# Altium schematic sheet Powersupply.SchDoc
size A4; SheetNumber: 5; SheetTotal: 22
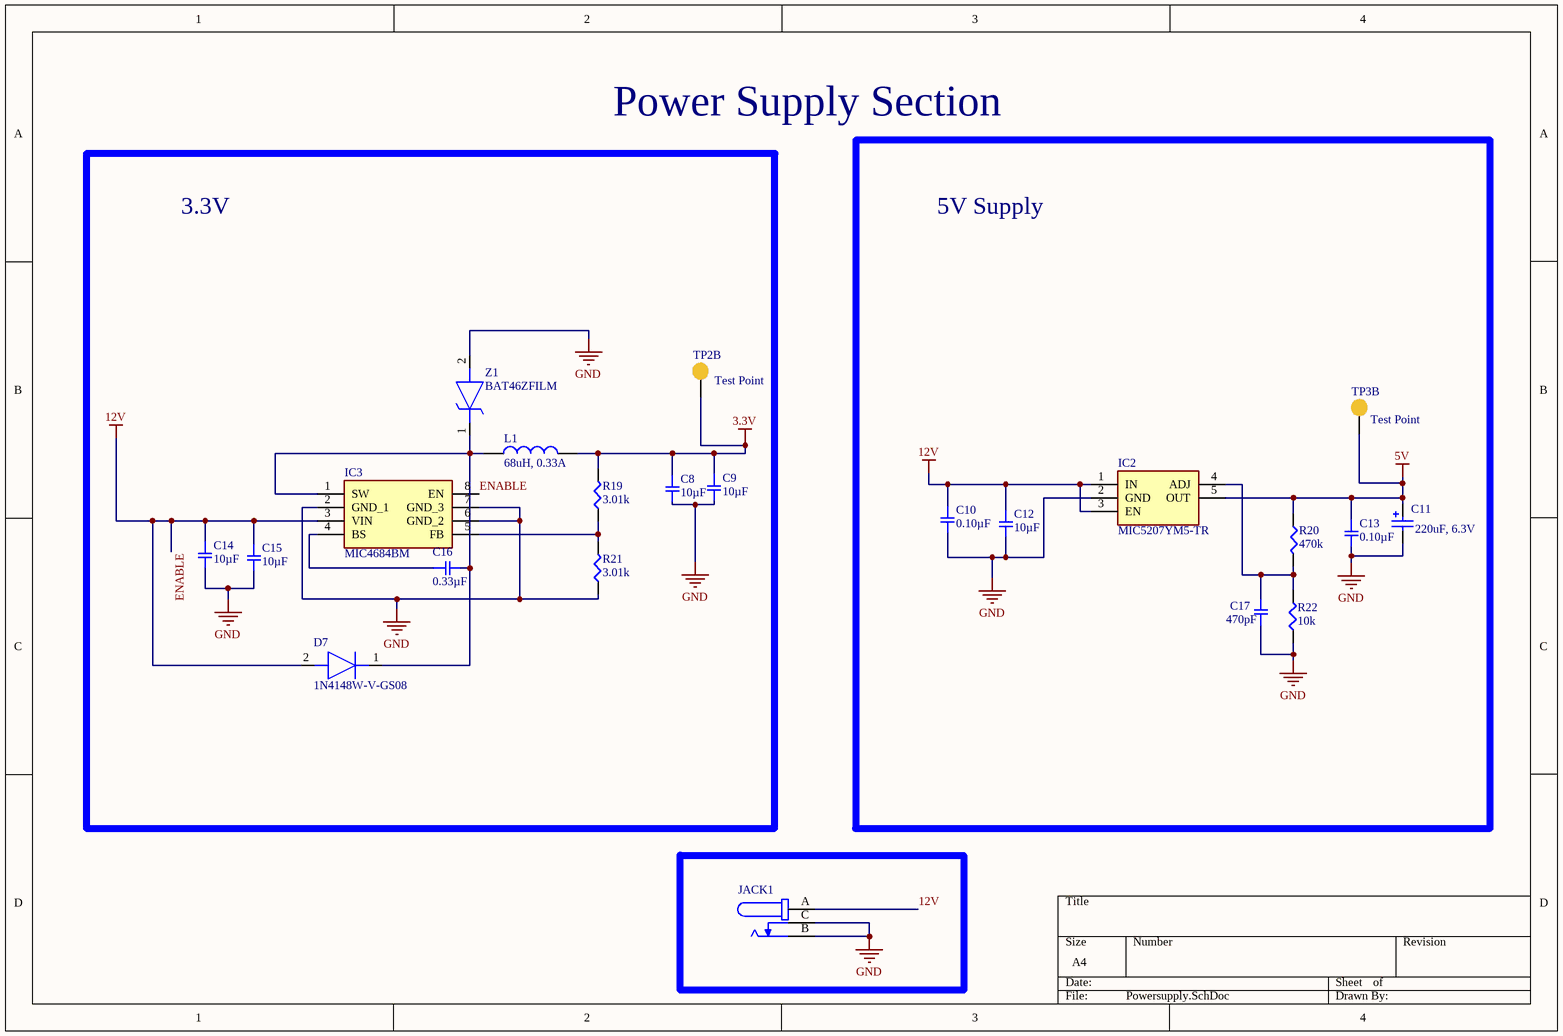
[diagram p0: Powersupply.SchDoc]

## Parts
C8  10µF  [SMD-0805C]
C9  10µF  [SMD-0805C]
C10  0.10µF  [SMD-0805C]
C11  220uF, 6.3V  [WCAP-ASLI_6.3x5.5]
C12  10µF  [SMD-0805C]
C13  0.10µF  [SMD-0805C]
C14  10µF  [SMD-0805C]
C15  10µF  [SMD-0805C]
C16  0.33µF  [SMD-0805C]
C17  470pF  [SMD-0805C]
D7  1N4148W-V-GS08  [1N4148WVGS08]
IC2  MIC5207YM5-TR  [SOT95P280X130-5N]
IC3  MIC4684BM  [SOIC127P602X173-8N]
JACK1  JACK  [JACK]  (value not drawn)
L1  68uH, 0.33A  [WE-LQ_1812]
R19  3.01k  [SMD-0805-RES]
R20  470k  [SMD-0805-RES]
R21  3.01k  [SMD-0805-RES]
R22  10k  [SMD-0805-RES]
TP2  Test Point  [pad2]  (part B of 2)
TP3  Test Point  [pad2]  (part B of 2)
Z1  BAT46ZFILM  [STPS0560Z]

## Blocks framed on the sheet
3.3V: C8 C9 C14-C16 D7 IC3 L1 R19 R21 TP2 Z1
5V Supply: C10-C13 C17 IC2 R20 R22 TP3

## Nets
3.3V: C8.1 C9.1 L1.2 R19.2 TP2.1
5V: C11.2(P) C13.1 IC2.5(OUT) R20.1 TP3.1
12V: C10.1 C12.1 C14.1 C15.1 D7.2(A) IC2.1(IN) IC2.3(EN) IC3.3(VIN) IC3.8(EN) JACK1.A  [also labelled ENABLE]
GND: C8.2 C9.2 C10.2 C11.1(N) C12.2 C13.2 C14.2 C15.2 C17.1 IC2.2(GND) IC3.2(GND_1) IC3.6(GND_2) IC3.7(GND_3) JACK1.B JACK1.C R21.1 R22.1 Z1.2(A)
NetC16_1: C16.1 IC3.4(BS)
NetC16_2: C16.2 D7.1(K) IC3.1(SW) L1.1 Z1.1(K)
NetC17_2: C17.2 IC2.4(ADJ) R20.2 R22.2
NetIC3_5: IC3.5(FB) R19.1 R21.2

## Notes on the sheet
- Power Supply Section

## Library data of the parts
C8 C9 C12 C14 C15 = GCJ21BR71A106KE01L: CAP CER 10UF 10V X7R 0805; Manufacturer: Murata Electronics North America; Factory Stock: 0; Unit Price (USD): 0.56; Minimum Quantity: 1; Tolerance: ±10%; Datasheets: http://www.murata.com/~/media/webrenewal/support/library/catalog/products/capacitor/mlcc/c03e.ashx; Image: //media.digikey.com/Renders/Murata%20Renders/0805%20(2012%20Metric)%20.85mm.jpg; Digi-Key Part Number: 490-12646-1-ND; Part Number: GCJ21BR71A106KE01L; Quantity Available: 2702; @ qty: 0; Packaging: Cut Tape (CT); Series: GCJ; Part Status: Active; Value: 10µF; Voltage: 10V; Temperature Coefficient: X7R; Operating Temperature: -55°C ~ 125°C; Features: Soft Termination; Ratings: AEC-Q200; Applications: Automotive, Boardflex Sensitive; Mounting Type: Surface Mount, MLCC; Package / Case: 0805 (2012 Metric); Size / Dimension: 0.079" L x 0.049" W (2.00mm x 1.25mm); Height - Seated (Max): -; Thickness (Max): 0.057" (1.45mm); Lead Spacing: -; Lead Style: -
C10 C13 = GCD21BR71H104KA01L: CAP CER 0.1UF 50V X7R 0805; Manufacturer: Murata Electronics North America; Factory Stock: 0; Unit Price (USD): 0.24; Minimum Quantity: 1; Tolerance: ±10%; Datasheets: http://www.murata.com/~/media/webrenewal/support/library/catalog/products/capacitor/mlcc/c03e.ashx; Image: //media.digikey.com/Renders/Murata%20Renders/0805%28GxM6%29.jpg; Digi-Key Part Number: 490-11955-1-ND; Part Number: GCD21BR71H104KA01L; Quantity Available: 157; @ qty: 0; Packaging: Cut Tape (CT); Series: GCD; Part Status: Active; Value: 0.10µF; Voltage: 50V; Temperature Coefficient: X7R; Operating Temperature: -55°C ~ 125°C; Features: -; Ratings: AEC-Q200; Applications: Automotive; Mounting Type: Surface Mount, MLCC; Package / Case: 0805 (2012 Metric); Size / Dimension: 0.079" L x 0.049" W (2.00mm x 1.25mm); Height - Seated (Max): -; Thickness (Max): 0.049" (1.25mm); Lead Spacing: -; Lead Style: -
C11 = 865080143009: WCAP-ASLI SMT Aluminum Electrolytic Capacitors, D6.3mm x L5.5mm, 220uF, +/-20%, 6.3VDC; Dissipation Factor: 24%; Endurance: 2000h; Leakage Current: 13.86uA; Ripple Current max.: 240mA; Technical Reference: ASED055221M6R3DVCTBB000; ComponentLink1Description: Manufacturer; ComponentLink1URL: http://www.we-online.de; ComponentLink2Description: Datasheet; ComponentLink2URL: https://katalog.we-online.com/pbs/datasheet/865080143009.pdf; Length: 5.5mm; Mounting Technology: SMT; Operating Temperature: -55 to +105degC; Packaging: Tape and Reel; Published Date: August 2019; Capacitance: 220uF; Diameter: 6.3mm; Part Number: 865080143009; Publisher: Wurth Elektronik; Capacitance Tolerance: +/-20%; Rated Voltage: 6.3VDC
C16 = GRM21BR71C334KA01L: CAP CER 0.33UF 16V X7R 0805; Manufacturer: Murata Electronics North America; Factory Stock: 0; Unit Price (USD): 0.25; Minimum Quantity: 1; Tolerance: ±10%; Datasheets: http://www.murata.com/~/media/webrenewal/support/library/catalog/products/capacitor/mlcc/c02e.pdf; Image: //media.digikey.com/Renders/Murata%20Renders/0805%20(2012%20Metric)%20.85mm.jpg; Digi-Key Part Number: 490-9752-1-ND; Part Number: GRM21BR71C334KA01L; Quantity Available: 4512; @ qty: 0; Packaging: Cut Tape (CT); Series: GRM; Part Status: Active; Value: 0.33µF; Voltage: 16V; Temperature Coefficient: X7R; Operating Temperature: -55°C ~ 125°C; Features: -; Ratings: -; Applications: General Purpose; Mounting Type: Surface Mount, MLCC; Package / Case: 0805 (2012 Metric); Size / Dimension: 0.079" L x 0.049" W (2.00mm x 1.25mm); Height - Seated (Max): -; Thickness (Max): 0.053" (1.35mm); Lead Spacing: -; Lead Style: -
C17 = GCM2165C1H471JA16D: CAP CER 470PF 50V NP0 0805; Manufacturer: Murata Electronics North America; Factory Stock: 0; Unit Price (USD): 0.24; Minimum Quantity: 1; Tolerance: ±5%; Temperature Coefficient: C0G, NP0; Datasheets: http://www.murata.com/~/media/webrenewal/support/library/catalog/products/capacitor/mlcc/c03e.ashx; Image: //media.digikey.com/Renders/Murata%20Renders/0805%28GxM6%29.jpg; Digi-Key Part Number: 490-6056-1-ND; Part Number: GCM2165C1H471JA16D; Quantity Available: 9612; @ qty: 0; Packaging: Cut Tape (CT); Series: GCM; Part Status: Active; Value: 470pF; Voltage: 50V; Operating Temperature: -55°C ~ 125°C; Features: -; Ratings: AEC-Q200; Applications: Automotive; Mounting Type: Surface Mount, MLCC; Package / Case: 0805 (2012 Metric); Size / Dimension: 0.079" L x 0.049" W (2.00mm x 1.25mm); Height - Seated (Max): -; Thickness (Max): 0.028" (0.70mm); Lead Spacing: -; Lead Style: -
D7 = 1N4148W-V-GS08: Diode; Manufacturer_Name: Vishay; Datasheet Link: https://us.rs-online.com/m/d/a2789c8794cb0c42ced29f2dd8571f3c.pdf; Height: 1.35mm; Manufacturer_Part_Number: 1N4148W-V-GS08; Mouser Part Number: 625-1N4148W-V; Mouser Price/Stock: https://www.mouser.co.uk/ProductDetail/Vishay-Semiconductors/1N4148W-V-GS08?qs=TNTIDjy6APrS%2Fdgq1RSs3A%3D%3D; Arrow Part Number: 1N4148W-V-GS08; Arrow Price/Stock: https://www.arrow.com/en/products/1n4148w-v-gs08/vishay
IC2 = MIC5207: Integrated Circuit; Manufacturer_Name: Microchip; Datasheet Link: https://ww1.microchip.com/downloads/aemDocuments/documents/OTH/ProductDocuments/DataSheets/MIC5207-180mA-Low-Noise-LDO-Regulator-DS20005719B.pdf; Height: 1.3mm; Manufacturer_Part_Number: MIC5207
IC3 = MIC4684BM: Integrated Circuit; Manufacturer_Name: Rochester Electronics; Datasheet Link: https://4donline.ihs.com/images/VipMasterIC/IC/RSEL/RSELS18597/RSELS19923-1.pdf?hkey=EF798316E3902B6ED9A73243A3159BB0; Height: 1.73mm; Manufacturer_Part_Number: MIC4684BM
L1 = 744045680: WE-LQ SMT Inductor, size 1812, 68uH, 0.33A; Manufacturer: Wurth Elektronik; DC Resistance max.: 2.1Ohm; Self Resonant Frequency: 15MHz; Q-Factor: 55; Saturation Current: 0.61A; ComponentLink1Description: Manufacturer; ComponentLink1URL: http://www.we-online.de; ComponentLink2Description: Datasheet; ComponentLink2URL: https://www.we-online.com/catalog/datasheet/744045680.pdf; Operating Temperature: -40 to +125degC; Packaging: Tape and Reel; Published Date: April 2020; Rated Current: 0.33A; Size: 1812; Inductance: 68uH; Manufacturer Part Number: 744045680; Mounting Technology: SMT
R19 R21 = ERJ-6ENF3011V: RES SMD 3.01K OHM 1% 1/8W 0805; Manufacturer: Panasonic Electronic Components; Factory Stock: 0; Unit Price (USD): 0.00729; @ qty: 1500; Minimum Quantity: 1; Power (Watts): 0.125W, 1/8W; Temperature Coefficient: ±100ppm/°C; Part Number: ERJ-6ENF3011V; Datasheets: http://industrial.panasonic.com/www-cgi/jvcr13pz.cgi?E+PZ+3+AOA0002+ERJ6ENF3011V+7+WW; Image: //media.digikey.com/Renders/Panasonic%20Renders/ERJ-0805%20Pkg.jpg; Digi-Key Part Number: P3.01KCCT-ND; Quantity Available: 48603; Packaging: Cut Tape (CT); Series: ERJ; Part Status: Active; Value: 3.01k; Tolerance: ±1%; Composition: Thick Film; Features: Automotive AEC-Q200; Operating Temperature: -55°C ~ 155°C; Package / Case: 0805 (2012 Metric); Supplier Device Package: 0805; Size / Dimension: 0.079" L x 0.049" W (2.00mm x 1.25mm); Height - Seated (Max): 0.028" (0.70mm); Number of Terminations: 2; Failure Rate: -
R20 = ERJ-P6WJ474V: RES SMD 470K OHM 5% 1/2W 0805; Manufacturer: Panasonic Electronic Components; Factory Stock: 0; Unit Price (USD): 0.08237; @ qty: 1500; Minimum Quantity: 1; Power (Watts): 0.5W, 1/2W; Temperature Coefficient: ±200ppm/°C; Part Number: ERJ-P6WJ474V; Datasheets: https://industrial.panasonic.com/cdbs/www-data/pdf/RDA0000/AOA0000C243.pdf; Image: //media.digikey.com/Renders/Panasonic%20Renders/ERJ-0805%20Pkg.jpg; Digi-Key Part Number: P16986CT-ND; Quantity Available: 4950; Packaging: Cut Tape (CT); Series: ERJ; Part Status: Active; Value: 470k; Tolerance: ±5%; Composition: Thick Film; Features: Automotive AEC-Q200, Pulse Withstanding; Operating Temperature: -55°C ~ 155°C; Package / Case: 0805 (2012 Metric); Supplier Device Package: 0805; Size / Dimension: 0.079" L x 0.049" W (2.00mm x 1.25mm); Height - Seated (Max): 0.030" (0.75mm); Number of Terminations: 2; Failure Rate: -
R22 = ERJ-P6WJ103V: RES SMD 10K OHM 5% 1/2W 0805; Manufacturer: Panasonic Electronic Components; Factory Stock: 0; Unit Price (USD): 0.08237; @ qty: 1500; Minimum Quantity: 1; Power (Watts): 0.5W, 1/2W; Temperature Coefficient: ±200ppm/°C; Part Number: ERJ-P6WJ103V; Datasheets: https://industrial.panasonic.com/cdbs/www-data/pdf/RDA0000/AOA0000C243.pdf; Image: //media.digikey.com/Renders/Panasonic%20Renders/ERJ-0805%20Pkg.jpg; Digi-Key Part Number: P16966CT-ND; Quantity Available: 2796; Packaging: Cut Tape (CT); Series: ERJ; Part Status: Active; Value: 10k; Tolerance: ±5%; Composition: Thick Film; Features: Automotive AEC-Q200, Pulse Withstanding; Operating Temperature: -55°C ~ 155°C; Package / Case: 0805 (2012 Metric); Supplier Device Package: 0805; Size / Dimension: 0.079" L x 0.049" W (2.00mm x 1.25mm); Height - Seated (Max): 0.030" (0.75mm); Number of Terminations: 2; Failure Rate: -
TP2 TP3 = pad2: Top Testpoint Pad
Z1 = BAT46ZFILM: Zener Diode; Manufacturer_Name: STMicroelectronics; Datasheet Link: https://datasheet.datasheetarchive.com/originals/distributors/SFDatasheet-5/sf-000113323.pdf; Manufacturer_Part_Number: BAT46ZFILM; Mouser Part Number: 511-BAT46ZFILM; Mouser Price/Stock: https://www.mouser.co.uk/ProductDetail/STMicroelectronics/BAT46ZFILM?qs=jZi1jxfVU96IWb4%2FLHMEiw%3D%3D; Arrow Part Number: BAT46ZFILM; Arrow Price/Stock: https://www.arrow.com/en/products/bat46zfilm/stmicroelectronics?region=nac